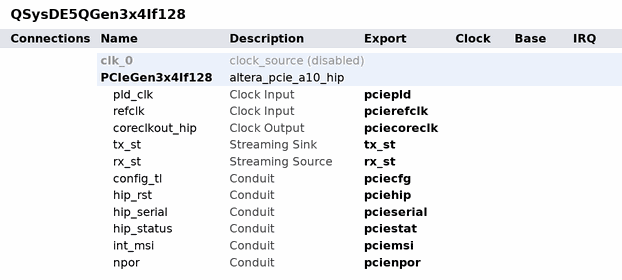
[diagram p0: system contents]
# Platform Designer (Qsys) system QSysDE5QGen3x4If128, Arria 10 10AX115S2F45I2SG
# Parameters at their usual value, and those the tool derives, are not listed.
package require -exact qsys 1.0
create_system QSysDE5QGen3x4If128
set_project_property DEVICE_FAMILY {Arria 10}
set_project_property DEVICE 10AX115S2F45I2SG

add_component clk_0 ip/QSysDE5QGen3x4If128/QSysDE5QGen3x4If128_clk_0.ip clock_source clk_0 0
set_instance_property clk_0 ENABLED false

add_component PCIeGen3x4If128 ip/QSysDE5QGen3x4If128/QSysDE5QGen3x4If128_PCIeGen3x4If128.ip altera_pcie_a10_hip PCIeGen3x4If128 17.1

# exported interfaces
add_interface pciecfg conduit end
set_interface_property pciecfg EXPORT_OF PCIeGen3x4If128.config_tl
add_interface pciecoreclk clock source
set_interface_property pciecoreclk EXPORT_OF PCIeGen3x4If128.coreclkout_hip
add_interface pciehip conduit end
set_interface_property pciehip EXPORT_OF PCIeGen3x4If128.hip_rst
add_interface pciemsi conduit end
set_interface_property pciemsi EXPORT_OF PCIeGen3x4If128.int_msi
add_interface pcienpor conduit end
set_interface_property pcienpor EXPORT_OF PCIeGen3x4If128.npor
add_interface pciepld clock sink
set_interface_property pciepld EXPORT_OF PCIeGen3x4If128.pld_clk
add_interface pcierefclk clock sink
set_interface_property pcierefclk EXPORT_OF PCIeGen3x4If128.refclk
add_interface pcieserial conduit end
set_interface_property pcieserial EXPORT_OF PCIeGen3x4If128.hip_serial
add_interface pciestat conduit end
set_interface_property pciestat EXPORT_OF PCIeGen3x4If128.hip_status
add_interface rx_st avalon_streaming source
set_interface_property rx_st EXPORT_OF PCIeGen3x4If128.rx_st
add_interface tx_st avalon_streaming sink
set_interface_property tx_st EXPORT_OF PCIeGen3x4If128.tx_st

set_interconnect_requirement {$system} qsys_mm.clockCrossingAdapter HANDSHAKE
set_interconnect_requirement {$system} qsys_mm.insertDefaultSlave false
set_interconnect_requirement {$system} qsys_mm.maxAdditionalLatency 1

save_system QSysDE5QGen3x4If128.qsys
